# Altium project MotorBoard.PrjPcb
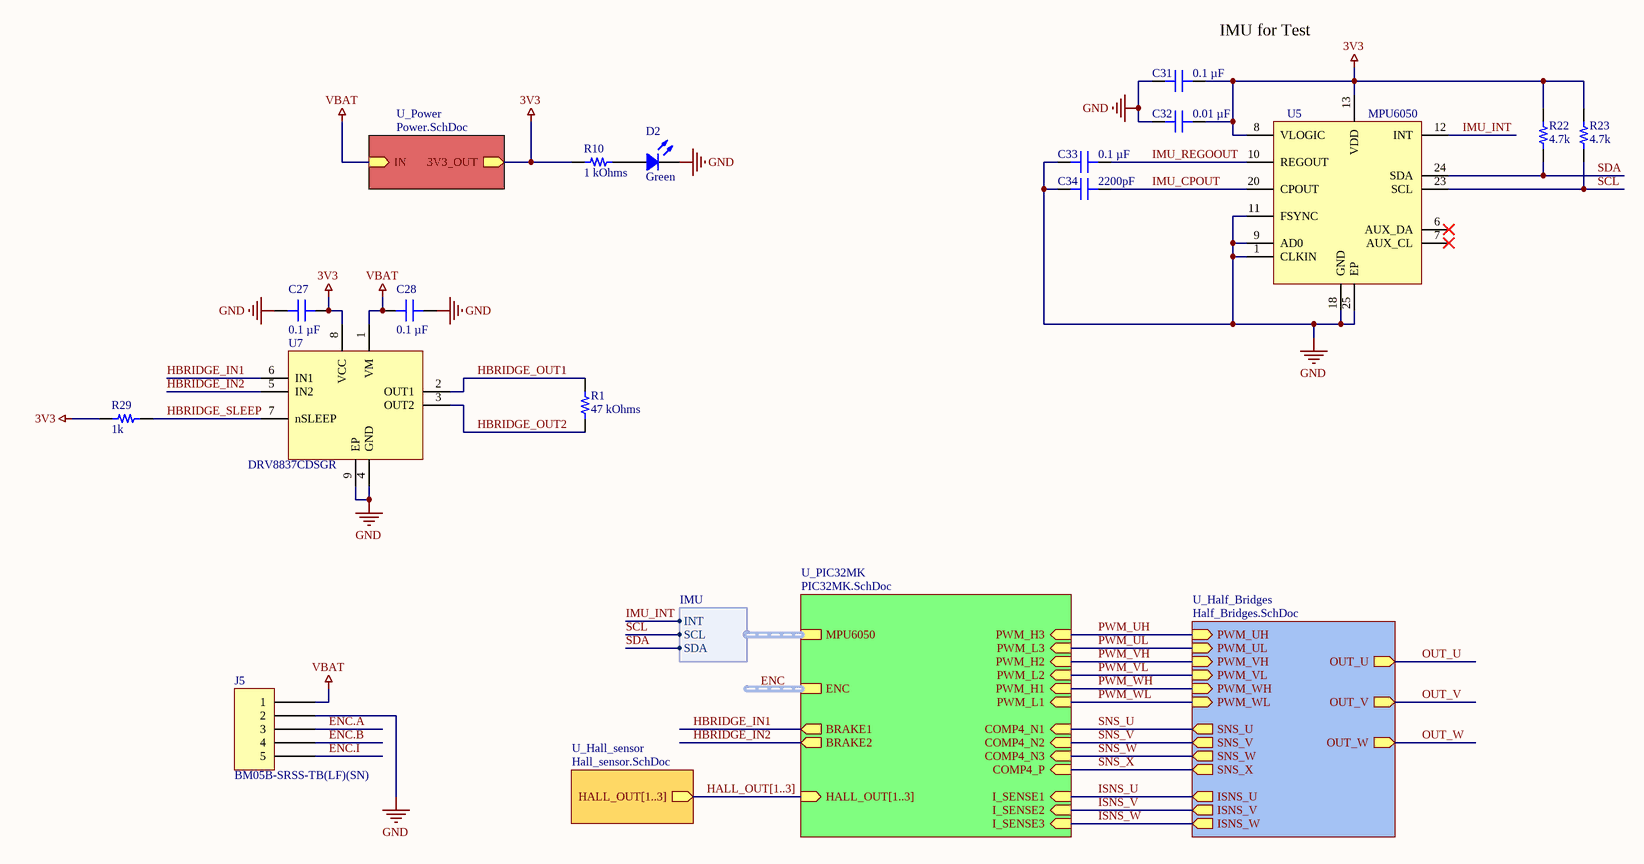
[diagram p0: Top.SchDoc]
Project: Cubli; ProjectRevision: 1.1
4 sheets, 109 parts. Net scope: hierarchical (ports join the sheet entries above them; power ports are global).
Board file: MotorBoard.PcbDoc
Sheets:
  Top.SchDoc
    U_PIC32MK = PIC32MK.SchDoc
    U_Power = Power.SchDoc
    U_Half_Bridges = Half_Bridges.SchDoc

## Sheet Top.SchDoc
size B; DocumentNumber: 5; Revision: 1.1; SheetNumber: 1; SheetTotal: 5

### Parts
(Parts that share a designator on the sheet are numbered #1, #2 ... from top to bottom, then left to right.)
C27  0.1 µF  [CAP 0402_1005]
C28  0.1 µF  [CAP 0402_1005]
C31  0.1 µF  [CAP 0402_1005]
C32  0.01 µF  [CAP 0402_1005]
C33  0.1 µF  [CAP 0402_1005]
C34  2200pF  [CAP 0402_1005]
D2  Green  [LED 0603_1608 GREEN]
J5  BM05B-SRSS-TB(LF)(SN)  [JST BM05B-SRSS-TB]
R1#1  47 kOhms  [RES 2512_6432]
R10#1  1 kOhms  [RES 0603_1608]
R22  4.7k  [RES 0402_1005]
R23  4.7k  [RES 0402_1005]
R29  1k  [RES 0402_1005]
U5  MPU6050  [IC_MPU6050]
U7#1  DRV8837CDSGR  [SON50P200X200X80-9N]

### Sub-sheets
U_Half_Bridges = Half_Bridges.SchDoc: PWM_UH (in), PWM_UL (in), PWM_VH (in), PWM_VL (in), PWM_WH (in), PWM_WL (in), SNS_U (out), SNS_V (out), SNS_W (out), SNS_X (out), OUT_U (out), OUT_V (out), OUT_W (out), ISNS_U (out), ISNS_V (out), ISNS_W (out)
U_Hall_sensor = Hall_sensor.SchDoc (file not in this document): HALL_OUT[1..3] (out)
U_PIC32MK = PIC32MK.SchDoc: HALL_OUT[1..3] (in), BRAKE2 (out), BRAKE1 (out), MPU6050 (harness IMU), PWM_L1 (in), PWM_H1 (in), PWM_L2 (in), PWM_H2 (in), PWM_L3 (in), PWM_H3 (in), ENC (harness ENC), I_SENSE1 (in), I_SENSE2 (in), I_SENSE3 (in), COMP4_P (in), COMP4_N1 (in), COMP4_N2 (in), COMP4_N3 (in)
U_Power = Power.SchDoc: 3V3_OUT (out), IN (in)

### Harnesses
IMU: INT, SCL, SDA

### Nets
3V3: C27.2 C31.2 C32.2 R10#1.1 R22.1 R23.1 R29.1 U5.8(VLOGIC) U5.13(VDD) U7#1.8(VCC) ; sheet U_Power/3V3_OUT
GND: C27.1 C28.2 C31.1 C32.1 C33.1 C34.1 D2.2 J5.2 U5.1(CLKIN) U5.9(AD0) U5.11(FSYNC) U5.18(GND) U5.25(EP) U7#1.4(GND) U7#1.9(EP)
VBAT: C28.1 J5.1 U7#1.1(VM) ; sheet U_Power/IN
ENC.A: J5.3
ENC.B: J5.4
ENC.I: J5.5
HBRIDGE_IN1: U7#1.6(IN1) ; sheet U_PIC32MK/BRAKE1
HBRIDGE_IN2: U7#1.5(IN2) ; sheet U_PIC32MK/BRAKE2
HBRIDGE_OUT1: R1#1.1 U7#1.2(OUT1)
HBRIDGE_OUT2: R1#1.2 U7#1.3(OUT2)
HBRIDGE_SLEEP: R29.2 U7#1.7(nSLEEP)
IMU_CPOUT: C34.2 U5.20(CPOUT)
IMU_INT: U5.12(INT) ; sheet U_PIC32MK/MPU6050.INT
IMU_REGOOUT: C33.2 U5.10(REGOUT)
ISNS_U: sheet U_PIC32MK/I_SENSE1, sheet U_Half_Bridges/ISNS_U
ISNS_V: sheet U_PIC32MK/I_SENSE2, sheet U_Half_Bridges/ISNS_V
ISNS_W: sheet U_PIC32MK/I_SENSE3, sheet U_Half_Bridges/ISNS_W
PWM_UH: sheet U_PIC32MK/PWM_H3, sheet U_Half_Bridges/PWM_UH
PWM_UL: sheet U_PIC32MK/PWM_L3, sheet U_Half_Bridges/PWM_UL
PWM_VH: sheet U_PIC32MK/PWM_H2, sheet U_Half_Bridges/PWM_VH
PWM_VL: sheet U_PIC32MK/PWM_L2, sheet U_Half_Bridges/PWM_VL
PWM_WH: sheet U_PIC32MK/PWM_H1, sheet U_Half_Bridges/PWM_WH
PWM_WL: sheet U_PIC32MK/PWM_L1, sheet U_Half_Bridges/PWM_WL
SCL: R23.2 U5.23(SCL) ; sheet U_PIC32MK/MPU6050.SCL
SDA: R22.2 U5.24(SDA) ; sheet U_PIC32MK/MPU6050.SDA
SNS_U: sheet U_PIC32MK/COMP4_N1, sheet U_Half_Bridges/SNS_U
SNS_V: sheet U_PIC32MK/COMP4_N2, sheet U_Half_Bridges/SNS_V
SNS_W: sheet U_PIC32MK/COMP4_N3, sheet U_Half_Bridges/SNS_W
SNS_X: sheet U_PIC32MK/COMP4_P, sheet U_Half_Bridges/SNS_X
NetD2_1: D2.1 R10#1.2

Not connected (* = marked no-connect by the designer): U5 6(AUX_DA)* 7(AUX_CL)*

### Buses and harness runs
bus HALL_OUT[1..3] = sheet U_Hall_sensor/HALL_OUT[1..3] = sheet U_PIC32MK/HALL_OUT[1..3]
harness ENC = sheet U_PIC32MK/ENC

### Notes on the sheet
- (near C31) IMU for Test

### Library data of the parts
C27 C28 C31 C33 = C0402C104K4RACAUTO: CAP CER 0.1UF 16V X7R 0402; manufacturer: KEMET; Tolerance: ±10%; Part Number: C0402C104K4RACAUTO; Value: 0.1 µF; Applications: Automotive, Bypass, Decoupling; Capacitance: 0.1 µF; componentlink1description: Datasheet; componentlink1url: https://api.kemet.com/component-edge/download/specsheet/C0402C104K4RACAUTO.pdf; componentlink2description: DigiKey Link; componentlink2url: https://www.digikey.com/en/products/detail/kemet/C0402C104K4RACAUTO/3314827; Device Package: 0402 (1005 Metric); lastupdated: 8/14/2022 9:05:51 PM; Lifecycle Status: Active; Minimum Order: 1; Mounting Type: Surface Mount, MLCC; Operating Temperature: -55°C ~ 125°C; Package / Case: 0402 (1005 Metric); packaging: TapeAndReel; partid: 3024; Part Status: Active; price: 0.01; Ratings: AEC-Q200; series: SMD Auto X7R; Size / Dimension: 0.039" L x 0.020" W (1.00mm x 0.50mm); Supplier 1: DigiKey; Supplier Part Number 1: 399-6828-1-ND; Temperature Coefficient: X7R; Thickness (Max): 0.022" (0.55mm); Voltage - Rated: 16V
C32 C34 = C0402C104K4RACAUTO: CAP CER 0.1UF 16V X7R 0402; manufacturer: KEMET; Capacitance: 0.1 µF; Tolerance: ±10%; Part Number: C0402C104K4RACAUTO; Applications: Automotive, Bypass, Decoupling; componentlink1description: Datasheet; componentlink1url: https://api.kemet.com/component-edge/download/specsheet/C0402C104K4RACAUTO.pdf; componentlink2description: DigiKey Link; componentlink2url: https://www.digikey.com/en/products/detail/kemet/C0402C104K4RACAUTO/3314827; Device Package: 0402 (1005 Metric); lastupdated: 8/14/2022 9:05:51 PM; Lifecycle Status: Active; Minimum Order: 1; Mounting Type: Surface Mount, MLCC; Operating Temperature: -55°C ~ 125°C; Package / Case: 0402 (1005 Metric); packaging: TapeAndReel; partid: 3024; Part Status: Active; price: 0.01; Ratings: AEC-Q200; series: SMD Auto X7R; Size / Dimension: 0.039" L x 0.020" W (1.00mm x 0.50mm); Supplier 1: DigiKey; Supplier Part Number 1: 399-6828-1-ND; Temperature Coefficient: X7R; Thickness (Max): 0.022" (0.55mm); Voltage - Rated: 16V
  C32: Value: 0.01 µF
  C34: Value: 2200pF
D2 = XZCDGK53W-8VF: 1.6X0.8MM LC GREEN PIXSOLED DOME; Manufacturer: SunLED; Configuration: Independent; Current - Test: 2mA; Lens Color: Colorless; Lens Size: 0.35mm Dia; Lens Style: Round with Domed Top; Lens Transparency: Clear; Millicandela Rating: 417mcd; Viewing Angle: 60°; Voltage - Forward (Vf) (Typ): 2.65V; Wavelength - Dominant: 525nm; Wavelength - Peak: 515nm; Part Number: XZCDGK53W-8VF; Color: Green; ComponentLink1Description: Datasheet; ComponentLink1URL: https://www.sunledusa.com/products/spec/XZCDGK53W-8VF.pdf; ComponentLink2Description: DigiKey Link; ComponentLink2URL: http://digikey.com/product-detail/en/sunled/XZCDGK53W-8VF/1497-XZCDGK53W-8VFCT-ND/10449792; Device Package: 0603 (1608 Metric); Height (Max): 1.10mm; LastUpdated: 21-Jan-20 3:12:09 AM; Lifecycle Status: Active; Minimum Order: 1; Mounting Type: Surface Mount; Package / Case: 0603 (1608 Metric); Packaging: Unknown; PartId: 938; Part Status: Active; Price: 0.18; Series: Ultra Low Current; Size / Dimension: 1.60mm L x 0.80mm W; Supplier 1: DigiKey; Supplier Part Number 1: 1497-XZCDGK53W-8VFCT-ND; Supplier Device Package: 2-SMD; Value: Green
J5 = BM05B-SRSS-TB(LF)(SN): CONN HEADER SMD 5POS 1MM; Manufacturer: JST Sales America Inc.; Current Rating (Amps): 0.7A; Material Flammability Rating: UL94 V-0; Number of Positions: 5; Number of Positions Loaded: All; Pitch - Mating: 0.039" (1.00mm); Shrouding: Shrouded - 4 Wall; Style: Board to Cable/Wire; Voltage Rating: 50V; Part Number: BM05B-SRSS-TB(LF)(SN); ComponentLink1Description: Datasheet; ComponentLink1URL: http://www.jst-mfg.com/product/pdf/eng/eSR.pdf; ComponentLink2Description: DigiKey Link; ComponentLink2URL: http://digikey.com/product-detail/en/jst-sales-america-inc/BM05B-SRSS-TB-LF-SN/455-1791-1-ND/926862; Connector Type: Header; Contact Finish - Mating: Tin; Contact Finish - Post: Tin; Contact Material: Copper Alloy; Contact Shape: Square; Contact Type: Male Pin; Fastening Type: Push-Pull; Features: Solder Retention; Insulation Color: Natural; Insulation Height: 0.167" (4.25mm); Insulation Material: Polyamide (PA), Nylon; LastUpdated: 1/12/2020 10:14:00 PM; Lifecycle Status: Active; Minimum Order: 1; Mounting Type: Surface Mount; Number of Rows: 1; Operating Temperature: -25°C ~ 85°C; Packaging: TapeAndReel; PartId: 18; Part Status: Active; Price: 0.35; Series: SR; Supplier 1: DigiKey; Supplier Part Number 1: 455-1791-1-ND; Termination: Solder
R1#1 = RK73B3ATTE473J: RES 47K OHM 5% 1W 2512; Manufacturer: KOA Speer Electronics, Inc.; Temperature Coefficient: ±200ppm/°C; Part Number: RK73B3ATTE473J; ComponentLink1Description: Datasheet; ComponentLink1URL: http://www.koaspeer.com/catimages/Products/RK73B/RK73B.pdf; ComponentLink2Description: DigiKey Link; ComponentLink2URL: http://digikey.com/product-detail/en/koa-speer-electronics-inc/RK73B3ATTE473J/2019-RK73B3ATTE473JCT-ND/10425370; Composition: Thick Film; Device Package: 2512 (6432 Metric); Features: Automotive AEC-Q200, Moisture Resistant; Height - Seated (Max): 0.028" (0.70mm); LastUpdated: 21-Jan-20 4:26:21 AM; Lifecycle Status: Active; Minimum Order: 1; Number of Terminations: 2; Operating Temperature: -55°C ~ 155°C; Package / Case: 2512 (6432 Metric); Packaging: TapeAndReel; Part Status: Active; Power (Watts): 1W; Price: 0.04; Ratings: AEC-Q200; Resistance: 47 kOhms; Series: RK73B; Size / Dimension: 0.248" L x 0.122" W (6.30mm x 3.10mm); Supplier 1: DigiKey; Supplier Part Number 1: 2019-RK73B3ATTE473JCT-ND; Supplier Device Package: 2512; Tolerance: ±5%; Value: 47 kOhms
R10#1 = RNCF0603DTE1K00: RES 1K OHM 0.5% 1/10W 0603; Manufacturer: Stackpole Electronics Inc; Power (Watts): 0.1W, 1/10W; Temperature Coefficient: ±25ppm/°C; Part Number: RNCF0603DTE1K00; Value: 1 kOhms; ComponentLink1Description: Datasheet; ComponentLink1URL: https://www.seielect.com/catalog/sei-rncf.pdf; ComponentLink2Description: DigiKey Link; ComponentLink2URL: http://digikey.com/product-detail/en/stackpole-electronics-inc/RNCF0603DTE1K00/RNCF0603DTE1K00CT-ND/9915086; Composition: Thin Film; Device Package: 0603 (1608 Metric); Features: Automotive AEC-Q200; Height - Seated (Max): 0.022" (0.55mm); LastUpdated: 21-Jan-20 12:14:28 AM; Lifecycle Status: Active; Minimum Order: 1; Number of Terminations: 2; Operating Temperature: -55°C ~ 155°C; Package / Case: 0603 (1608 Metric); Packaging: TapeAndReel; PartId: 26300; Part Status: Active; Price: 0.05; Ratings: AEC-Q200; Resistance: 1 kOhms; Series: RNCF; Size / Dimension: 0.061" L x 0.031" W (1.55mm x 0.80mm); Supplier 1: DigiKey; Supplier Part Number 1: RNCF0603DTE1K00CT-ND; Supplier Device Package: 0603; Tolerance: ±0.5%
R22 R23 R29 = RK73H1ETTP1432F: RES 14.3K OHM 1% 1/10W 0402; Manufacturer: KOA Speer Electronics, Inc.; Power (Watts): 0.1W, 1/10W; Resistance: 14.3 kOhms; Temperature Coefficient: ±100ppm/°C; Part Number: RK73H1ETTP1432F; ComponentLink1Description: Datasheet; ComponentLink1URL: http://www.koaspeer.com/catimages/Products/RK73H/RK73H.pdf; ComponentLink2Description: DigiKey Link; ComponentLink2URL: https://www.digikey.com/en/products/detail/koa-speer-electronics-inc/RK73H1ETTP1432F/9844351; Composition: Thick Film; Device Package: 0402 (1005 Metric); Features: Automotive AEC-Q200, Moisture Resistant; Height - Seated (Max): 0.016" (0.40mm); LastUpdated: 8/14/2022 9:23:49 PM; Lifecycle Status: Active; Minimum Order: 1; Number of Terminations: 2; Operating Temperature: -55°C ~ 155°C; Package / Case: 0402 (1005 Metric); Packaging: CutTape; PartId: 10193; Part Status: Active; Price: 0.01; Ratings: AEC-Q200; Series: RK73H; Size / Dimension: 0.039" L x 0.020" W (1.00mm x 0.50mm); Supplier 1: DigiKey; Supplier Part Number 1: 2019-RK73H1ETTP1432FCT-ND; Supplier Device Package: 0402; Tolerance: ±1%
  R22 R23: Value: 4.7k
  R29: Value: 1k
U7#1 = DRV8837CDSGR: 11-V, 1-A H-bridge motor driver 8-WSON -40 to 85; MF: Texas Instruments; Mouser-Purchase-URL: https://snapeda.com/shop?store=Mouser&id=617854; Value: *; DigiKey-Purchase-URL: https://snapeda.com/shop?store=DigiKey&id=617854; Package: WSON-8 Texas Instruments; Texas_Instruments-Purchase-URL: https://snapeda.com/shop?store=Texas+Instruments&id=617854; Price: None; MP: DRV8837CDSGR; SnapEDA_Link: https://www.snapeda.com/parts/DRV8837CDSGR/Texas%20Instruments/view-part/617854/?ref=snap; Availability: Good

## Sheet PIC32MK.SchDoc
size B; DocumentNumber: 3; SheetNumber: 3; SheetTotal: 5
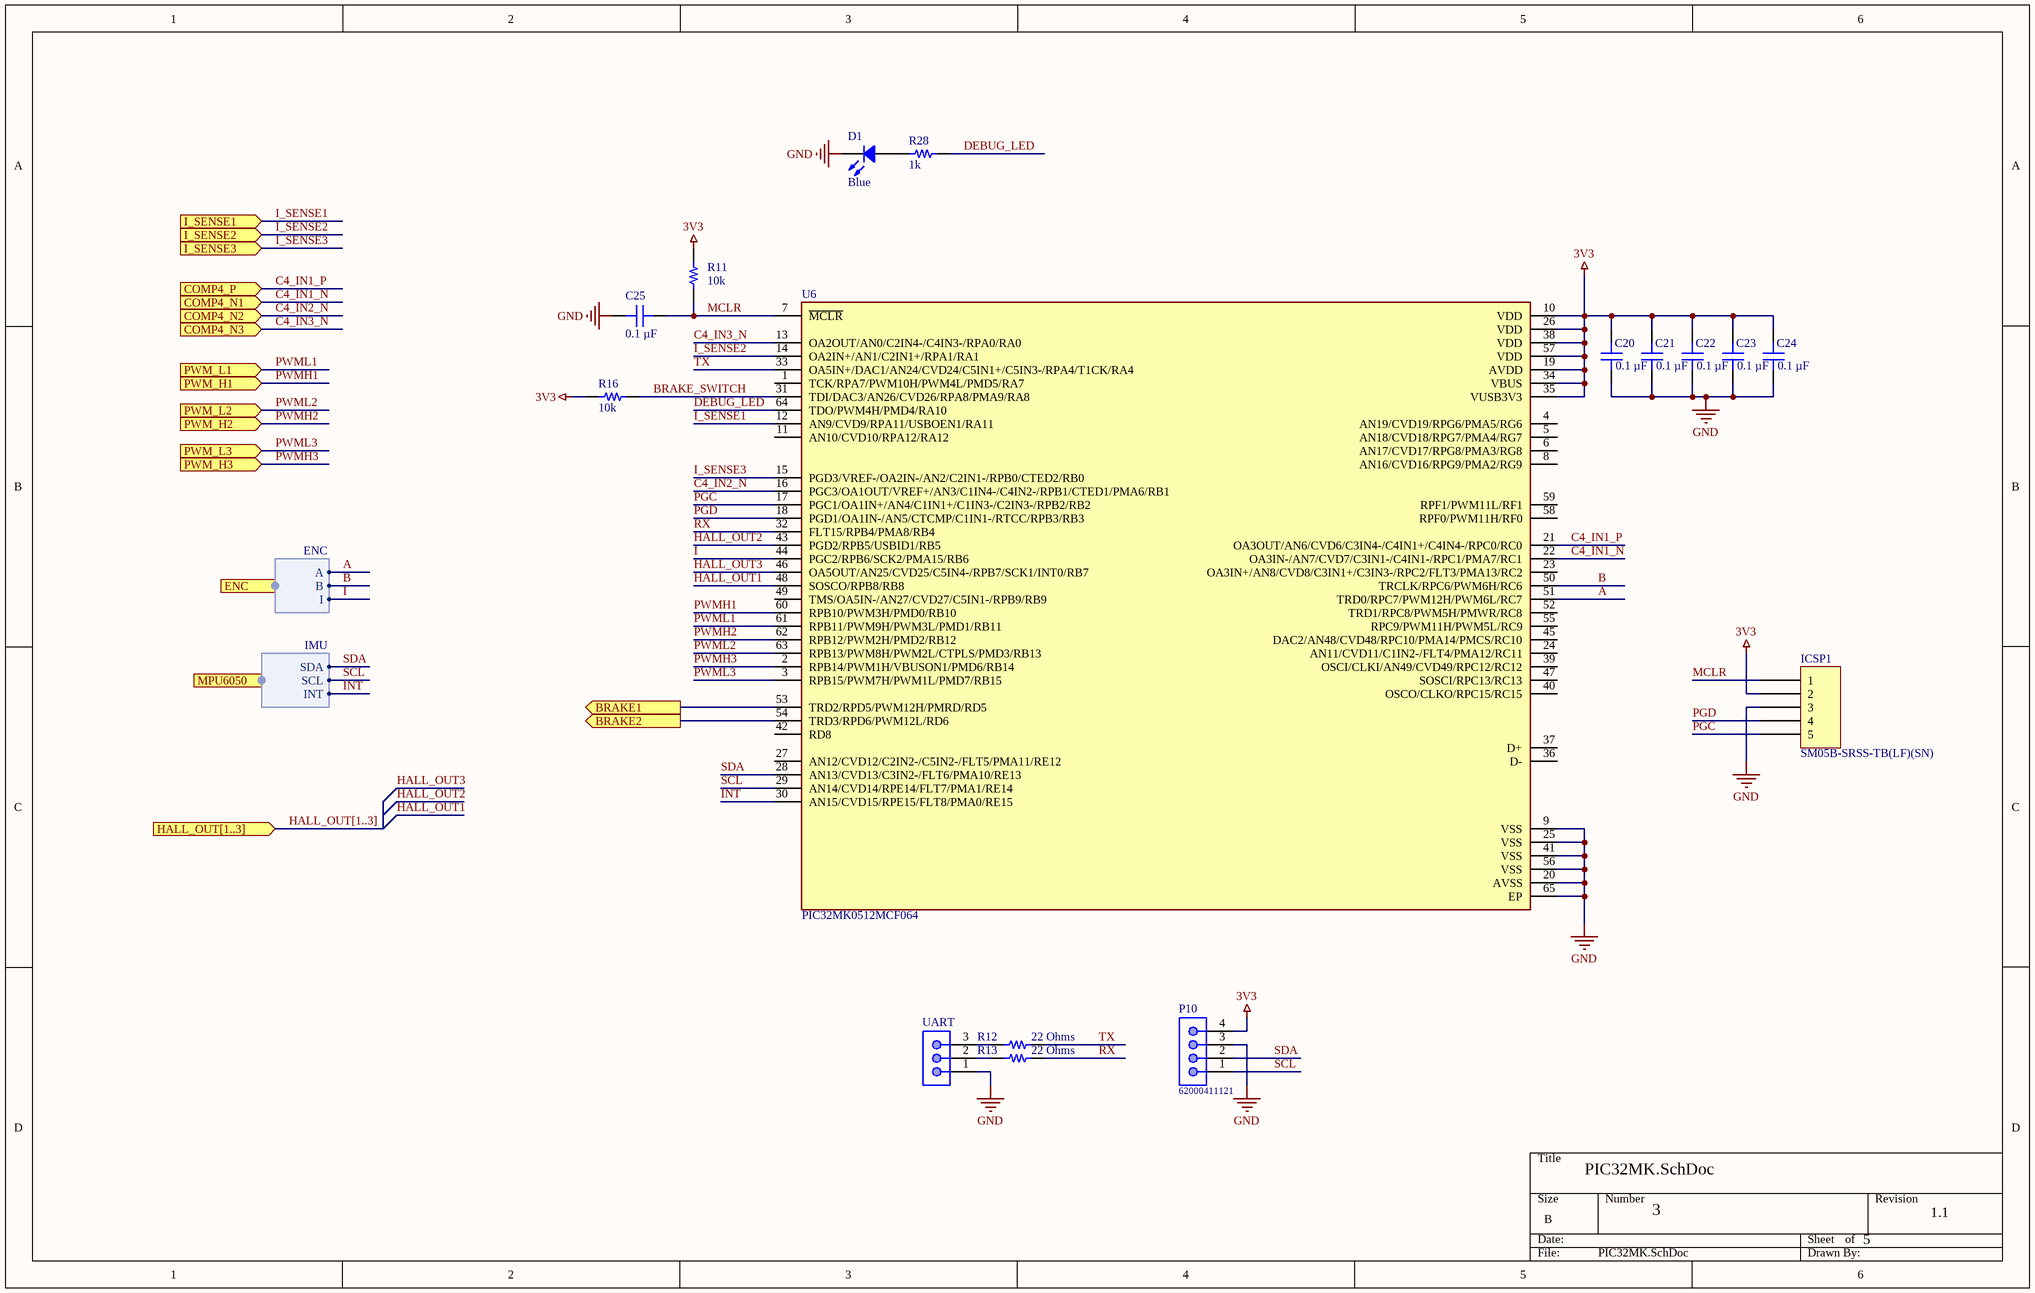
[diagram p1: PIC32MK.SchDoc]

### Parts
(Parts that share a designator on the sheet are numbered #1, #2 ... from top to bottom, then left to right.)
C20  0.1 µF  [CAP 0402_1005]
C21  0.1 µF  [CAP 0402_1005]
C22  0.1 µF  [CAP 0402_1005]
C23  0.1 µF  [CAP 0402_1005]
C24  0.1 µF  [CAP 0402_1005]
C25  0.1 µF  [CAP 0402_1005]
D1  Blue  [LED 0603_1608 GREEN]
ICSP1  SM05B-SRSS-TB(LF)(SN)  [JST SM05B-SRSS-TB]
P10  62000411121  [62000411121]
R11  10k  [RES 0402_1005]
R12#1  22 Ohms  [RES 0402_1005]
R13#1  22 Ohms  [RES 0402_1005]
R16#1  10k  [RES 0402_1005]
R28  1k  [RES 0402_1005]
U6  PIC32MK0512MCF064  [QFN50P900X900X100-65N]
UART  3 pin 2mm JST Male  [3pin - 2mm header]  (value not drawn)

### Ports
BRAKE1 (out), BRAKE2 (out), COMP4_N1 (in), COMP4_N2 (in), COMP4_N3 (in), COMP4_P (in), ENC (harness ENC), HALL_OUT[1..3] (in), I_SENSE1 (in), I_SENSE2 (in), I_SENSE3 (in), MPU6050 (harness IMU), PWM_H1 (in), PWM_H2 (in), PWM_H3 (in), PWM_L1 (in), PWM_L2 (in), PWM_L3 (in)

### Harnesses
IMU: SDA, SCL, INT
ENC: A, B, I

### Nets
3V3: C20.2 C21.2 C22.2 C23.2 C24.2 ICSP1.2 P10.4 R11.2 R16#1.2 U6.10(VDD) U6.19(AVDD) U6.26(VDD) U6.34(VBUS) U6.35(VUSB3V3) U6.38(VDD) U6.57(VDD)
GND: C20.1 C21.1 C22.1 C23.1 C24.1 C25.2 D1.2 ICSP1.3 P10.3 U6.9(VSS) U6.20(AVSS) U6.25(VSS) U6.41(VSS) U6.56(VSS) U6.65(EP) UART.1
A: U6.51(TRD0/RPC7/PWM12H/PWM6L/RC7) ; port ENC.A  [project net ENC.A]
B: U6.50(TRCLK/RPC6/PWM6H/RC6) ; port ENC.B  [project net ENC.B]
BRAKE_SWITCH: R16#1.1 U6.31(TDI/DAC3/AN26/CVD26/RPA8/PMA9/RA8)
C4_IN1_N: U6.22(OA3IN-/AN7/CVD7/C3IN1-/C4IN1-/RPC1/PMA7/RC1) ; port COMP4_N1  [project net SNS_U]
C4_IN1_P: U6.21(OA3OUT/AN6/CVD6/C3IN4-/C4IN1+/C4IN4-/RPC0/RC0) ; port COMP4_P  [project net SNS_X]
C4_IN2_N: U6.16(PGC3/OA1OUT/VREF+/AN3/C1IN4-/C4IN2-/RPB1/CTED1/PMA6/RB1) ; port COMP4_N2  [project net SNS_V]
C4_IN3_N: U6.13(OA2OUT/AN0/C2IN4-/C4IN3-/RPA0/RA0) ; port COMP4_N3  [project net SNS_W]
DEBUG_LED: R28.1 U6.64(TDO/PWM4H/PMD4/RA10)
HALL_OUT1: U6.48(SOSCO/RPB8/RB8)
HALL_OUT2: U6.43(PGD2/RPB5/USBID1/RB5)
HALL_OUT3: U6.46(OA5OUT/AN25/CVD25/C5IN4-/RPB7/SCK1/INT0/RB7)
HBRIDGE_IN1: U6.53(TRD2/RPD5/PWM12H/PMRD/RD5) ; port BRAKE1
HBRIDGE_IN2: U6.54(TRD3/RPD6/PWM12L/RD6) ; port BRAKE2
I: U6.44(PGC2/RPB6/SCK2/PMA15/RB6) ; port ENC.I  [project net ENC.I]
I_SENSE1: U6.12(AN9/CVD9/RPA11/USBOEN1/RA11) ; port I_SENSE1  [project net ISNS_U]
I_SENSE2: U6.14(OA2IN+/AN1/C2IN1+/RPA1/RA1) ; port I_SENSE2  [project net ISNS_V]
I_SENSE3: U6.15(PGD3/VREF-/OA2IN-/AN2/C2IN1-/RPB0/CTED2/RB0) ; port I_SENSE3  [project net ISNS_W]
INT: U6.30(AN15/CVD15/RPE15/FLT8/PMA0/RE15) ; port MPU6050.INT  [project net IMU_INT]
MCLR: C25.1 ICSP1.1 R11.1 U6.7(~{MCLR})
PGC: ICSP1.5 U6.17(PGC1/OA1IN+/AN4/C1IN1+/C1IN3-/C2IN3-/RPB2/RB2)
PGD: ICSP1.4 U6.18(PGD1/OA1IN-/AN5/CTCMP/C1IN1-/RTCC/RPB3/RB3)
PWMH1: U6.60(RPB10/PWM3H/PMD0/RB10) ; port PWM_H1  [project net PWM_WH]
PWMH2: U6.62(RPB12/PWM2H/PMD2/RB12) ; port PWM_H2  [project net PWM_VH]
PWMH3: U6.2(RPB14/PWM1H/VBUSON1/PMD6/RB14) ; port PWM_H3  [project net PWM_UH]
PWML1: U6.61(RPB11/PWM9H/PWM3L/PMD1/RB11) ; port PWM_L1  [project net PWM_WL]
PWML2: U6.63(RPB13/PWM8H/PWM2L/CTPLS/PMD3/RB13) ; port PWM_L2  [project net PWM_VL]
PWML3: U6.3(RPB15/PWM7H/PWM1L/PMD7/RB15) ; port PWM_L3  [project net PWM_UL]
RX: R13#1.1 U6.32(FLT15/RPB4/PMA8/RB4)
SCL: P10.1 U6.29(AN14/CVD14/RPE14/FLT7/PMA1/RE14) ; port MPU6050.SCL
SDA: P10.2 U6.28(AN13/CVD13/C3IN2-/FLT6/PMA10/RE13) ; port MPU6050.SDA
TX: R12#1.1 U6.33(OA5IN+/DAC1/AN24/CVD24/C5IN1+/C5IN3-/RPA4/T1CK/RA4)
NetD1_1: D1.1 R28.2
NetR12#1_2: R12#1.2 UART.3
NetR13#1_2: R13#1.2 UART.2

Not connected (* = marked no-connect by the designer): U6 1(TCK/RPA7/PWM10H/PWM4L/PMD5/RA7) 4(AN19/CVD19/RPG6/PMA5/RG6) 5(AN18/CVD18/RPG7/PMA4/RG7) 6(AN17/CVD17/RPG8/PMA3/RG8) 8(AN16/CVD16/RPG9/PMA2/RG9) 11(AN10/CVD10/RPA12/RA12) 23(OA3IN+/AN8/CVD8/C3IN1+/C3IN3-/RPC2/FLT3/PMA13/RC2) 24(AN11/CVD11/C1IN2-/FLT4/PMA12/RC11) 27(AN12/CVD12/C2IN2-/C5IN2-/FLT5/PMA11/RE12) 36(D-) 37(D+) 39(OSCI/CLKI/AN49/CVD49/RPC12/RC12) 40(OSCO/CLKO/RPC15/RC15) 42(RD8) 45(DAC2/AN48/CVD48/RPC10/PMA14/PMCS/RC10) 47(SOSCI/RPC13/RC13) 49(TMS/OA5IN-/AN27/CVD27/C5IN1-/RPB9/RB9) 52(TRD1/RPC8/PWM5H/PMWR/RC8) 55(RPC9/PWM11H/PWM5L/RC9) 58(RPF0/PWM11H/RF0) 59(RPF1/PWM11L/RF1)

### Buses and harness runs
bus HALL_OUT[1..3] = port HALL_OUT[1..3]

### Library data of the parts
C20-C25 = C0402C104K4RACAUTO: as C27 on sheet Top; Part Number: C0402C104K4RACAUTO; Value: 0.1 µF; Applications: Automotive, Bypass, Decoupling; Capacitance: 0.1 µF; componentlink1description: Datasheet; componentlink1url: https://api.kemet.com/component-edge/download/specsheet/C0402C104K4RACAUTO.pdf; componentlink2description: DigiKey Link; componentlink2url: https://www.digikey.com/en/products/detail/kemet/C0402C104K4RACAUTO/3314827; Device Package: 0402 (1005 Metric); lastupdated: 8/14/2022 9:05:51 PM; Lifecycle Status: Active; Minimum Order: 1; Mounting Type: Surface Mount, MLCC; Operating Temperature: -55°C ~ 125°C; Package / Case: 0402 (1005 Metric); packaging: TapeAndReel; partid: 3024; Part Status: Active; price: 0.01; Ratings: AEC-Q200; series: SMD Auto X7R; Size / Dimension: 0.039" L x 0.020" W (1.00mm x 0.50mm); Supplier 1: DigiKey; Supplier Part Number 1: 399-6828-1-ND; Temperature Coefficient: X7R; Thickness (Max): 0.022" (0.55mm); Voltage - Rated: 16V
D1 = XZCDGK53W-8VF: Blue LED; Manufacturer: SunLED; Color: Green; Configuration: Independent; Current - Test: 2mA; Lens Color: Colorless; Lens Size: 0.35mm Dia; Lens Style: Round with Domed Top; Lens Transparency: Clear; Millicandela Rating: 417mcd; Value: Green; Viewing Angle: 60°; Voltage - Forward (Vf) (Typ): 2.65V; Wavelength - Dominant: 525nm; Wavelength - Peak: 515nm; Part Number: XZCDGK53W-8VF; ComponentLink1Description: Datasheet; ComponentLink1URL: https://www.sunledusa.com/products/spec/XZCDGK53W-8VF.pdf; ComponentLink2Description: DigiKey Link; ComponentLink2URL: http://digikey.com/product-detail/en/sunled/XZCDGK53W-8VF/1497-XZCDGK53W-8VFCT-ND/10449792; Device Package: 0603 (1608 Metric); Height (Max): 1.10mm; LastUpdated: 21-Jan-20 3:12:09 AM; Lifecycle Status: Active; Minimum Order: 1; Mounting Type: Surface Mount; Package / Case: 0603 (1608 Metric); Packaging: Unknown; PartId: 938; Part Status: Active; Price: 0.18; Series: Ultra Low Current; Size / Dimension: 1.60mm L x 0.80mm W; Supplier 1: DigiKey; Supplier Part Number 1: 1497-XZCDGK53W-8VFCT-ND; Supplier Device Package: 2-SMD
ICSP1 = SM05B-SRSS-TB(LF)(SN): CONN HEADER SMD R/A 5POS 1MM; Manufacturer: JST Sales America Inc.; Current Rating (Amps): 0.7A; Material Flammability Rating: UL94 V-0; Number of Positions: 5; Number of Positions Loaded: All; Pitch - Mating: 0.039" (1.00mm); Shrouding: Shrouded - 4 Wall; Style: Board to Cable/Wire; Voltage Rating: 50V; Part Number: SM05B-SRSS-TB(LF)(SN); ComponentLink1Description: Datasheet; ComponentLink1URL: http://www.jst-mfg.com/product/pdf/eng/eSH.pdf; ComponentLink2Description: DigiKey Link; ComponentLink2URL: http://digikey.com/product-detail/en/jst-sales-america-inc/SM05B-SRSS-TB-LF-SN/455-1805-1-ND/926876; Connector Type: Header; Contact Finish - Mating: Tin; Contact Finish - Post: Tin; Contact Material: Copper Alloy; Contact Shape: Square; Contact Type: Male Pin; Fastening Type: Push-Pull; Features: Solder Retention; Insulation Color: Natural; Insulation Height: 0.114" (2.90mm); Insulation Material: Polyamide (PA), Nylon; LastUpdated: 1/12/2020 11:42:04 PM; Lifecycle Status: Active; Minimum Order: 1; Mounting Type: Surface Mount, Right Angle; Number of Rows: 1; Operating Temperature: -25°C ~ 85°C; Packaging: TapeAndReel; PartId: 63; Part Status: Active; Price: 0.32; Series: SR; Supplier 1: DigiKey; Supplier Part Number 1: 455-1805-1-ND; Termination: Solder
P10 = 62000411121: WR-PHD Pin Header, THT, pitch 2mm, Single Row, Vertical, 4p; Manufacturer: Wurth Elektronik; Pin Number: 4; Rated Current: 2A; Working Voltage: 200VAC; Withstanding Voltage: 500VAC; Contact Resistance: 20mOhm; ComponentLink1Description: Manufacturer; ComponentLink1URL: http://www.we-online.de; ComponentLink2Description: Datasheet; ComponentLink2URL: https://www.we-online.com/catalog/datasheet/62000411121.pdf; Operating Temperature: -40 to +105degC; Published Date: May 2020; Pitch: 2mm; Manufacturer Part Number: 62000411121; Mounting Technology: THT; Packaging: Bag; Gender: Pin Header; Row Number: Single; Orientation: Vertical
R11 R12#1 R13#1 R16#1 R28 = RK73H1ETTP1432F: as R22 on sheet Top; Part Number: RK73H1ETTP1432F; ComponentLink1Description: Datasheet; ComponentLink1URL: http://www.koaspeer.com/catimages/Products/RK73H/RK73H.pdf; ComponentLink2Description: DigiKey Link; ComponentLink2URL: https://www.digikey.com/en/products/detail/koa-speer-electronics-inc/RK73H1ETTP1432F/9844351; Composition: Thick Film; Device Package: 0402 (1005 Metric); Features: Automotive AEC-Q200, Moisture Resistant; Height - Seated (Max): 0.016" (0.40mm); LastUpdated: 8/14/2022 9:23:49 PM; Lifecycle Status: Active; Minimum Order: 1; Number of Terminations: 2; Operating Temperature: -55°C ~ 155°C; Package / Case: 0402 (1005 Metric); Packaging: CutTape; PartId: 10193; Part Status: Active; Price: 0.01; Ratings: AEC-Q200; Series: RK73H; Size / Dimension: 0.039" L x 0.020" W (1.00mm x 0.50mm); Supplier 1: DigiKey; Supplier Part Number 1: 2019-RK73H1ETTP1432FCT-ND; Supplier Device Package: 0402; Tolerance: ±1%
  R11 R16#1: Value: 10k
  R12#1 R13#1: Value: 22 Ohms
  R28: Value: 1k
U6 = PIC32MK0512MCF064: PIC32MK Microcontroller IC 32-Bit 120MHz 1MB _1M x 8_ FLASH 64-TQFP _10x10_; MP: PIC32MK1024MCF064-I/PT; MF: Microchip; Digi-Key_Purchase_URL: https://www.digikey.kr/product-detail/en/microchip-technology/PIC32MK1024MCF064-I-PT/PIC32MK1024MCF064-I-PT-ND/7164902?utm_source=snapeda&utm_medium=aggregator&utm_campaign=symbol; Package: TQFP-64 Microchip; Digi-Key_Part_Number: PIC32MK1024MCF064-I/PT-ND; Value: *; SnapEDA_Link: https://www.snapeda.com/parts/PIC32MK1024MCF064-I/PT/Microchip/view-part/876704/?ref=snap

## Sheet Power.SchDoc
size B; DocumentNumber: 4; SheetNumber: 4; SheetTotal: 5
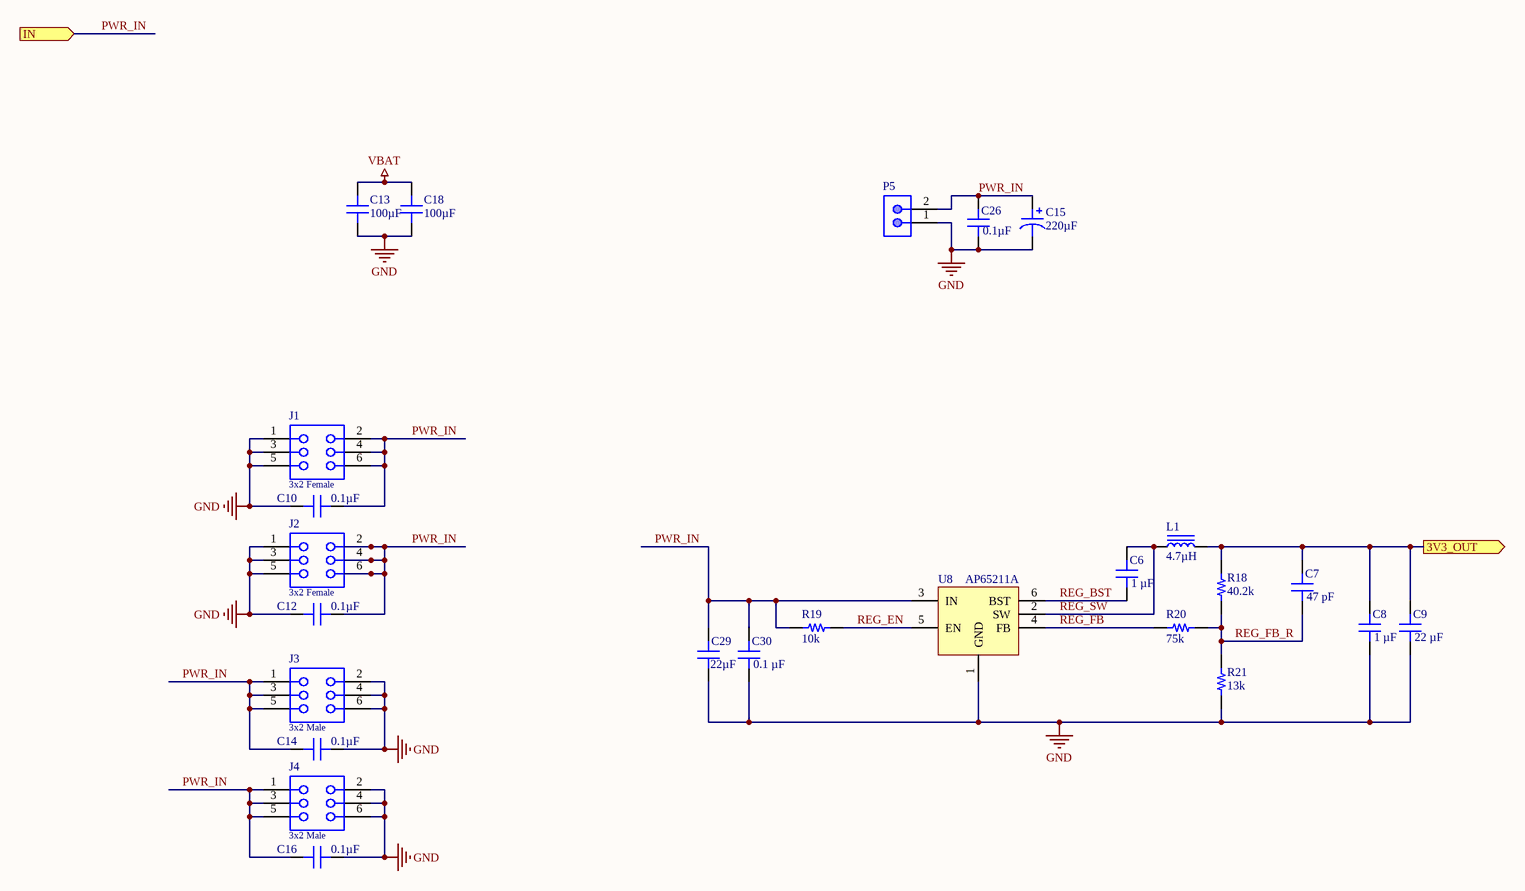
[diagram p2: Power.SchDoc]

### Parts
(Parts that share a designator on the sheet are numbered #1, #2 ... from top to bottom, then left to right.)
C6#1  1 µF  [CAP 0402_1005]
C7#1  47 pF  [CAP 0402_1005]
C8#1  1 µF  [CAP 0402_1005]
C9#1  22 µF  [CAP 0402_1005]
C10  0.1µF  [CAP 0603_1608]
C12  0.1µF  [CAP 0603_1608]
C13  100µF  [CAP 1210_3225 - 2.8MM]
C14  0.1µF  [CAP 0603_1608]
C15  220µF  [CAP POL 2917_7343]
C16  0.1µF  [CAP 0603_1608]
C18#1  100µF  [CAP 1210_3225 - 2.8MM]
C26  0.1µF  [CAP 0603_1608]
C29  22µF  [CAP 0805_2012]
C30  0.1 µF  [CAP 0402_1005]
J1  3x2 Female  [62000621821]
J2  3x2 Female  [62000621821]
J3  3x2 Male  [2mm 3x2 Male Right - duplicate]
J4  3x2 Male  [2mm 3x2 Male Right - duplicate]
L1  4.7µH  [IND 1008_2520]
P5  2 pin 2mm JST Male  [2pin - 2mm JST male]  (value not drawn)
R18  40.2k  [RES 0402_1005]
R19  10k  [RES 0402_1005]
R20  75k  [RES 0402_1005]
R21  13k  [RES 0402_1005]
U8#1  AP65211A  [TSOT-26-6]

### Ports
3V3_OUT (out), IN (in)

### Nets
3V3: C7#1.2 C8#1.2 C9#1.2 L1.2 R18.1 ; port 3V3_OUT
GND: C8#1.1 C9#1.1 C10.1 C12.1 C13.1 C14.2 C15.2 C16.2 C18#1.1 C26.2 C29.1 C30.1 J1.1 J1.3 J1.5 J2.1 J2.3 J2.5 J3.2 J3.4 J3.6 J4.2 J4.4 J4.6 P5.1 R21.2 U8#1.1(GND)
VBAT: C10.2 C12.2 C13.2 C14.1 C15.1 C16.1 C18#1.2 C26.1 C29.2 C30.2 J1.2 J1.4 J1.6 J2.2 J2.4 J2.6 J3.1 J3.3 J3.5 J4.1 J4.3 J4.5 P5.2 R19.2 U8#1.3(IN) ; port IN  [also labelled PWR_IN]
REG_BST: C6#1.1 U8#1.6(BST)
REG_EN: R19.1 U8#1.5(EN)
REG_FB: R20.2 U8#1.4(FB)
REG_FB_R: C7#1.1 R18.2 R20.1 R21.1
REG_SW: C6#1.2 L1.1 U8#1.2(SW)

### Library data of the parts
C6#1 C7#1 C8#1 C9#1 = C0402C104K4RACAUTO: as C32 on sheet Top; Part Number: C0402C104K4RACAUTO; Applications: Automotive, Bypass, Decoupling; componentlink1description: Datasheet; componentlink1url: https://api.kemet.com/component-edge/download/specsheet/C0402C104K4RACAUTO.pdf; componentlink2description: DigiKey Link; componentlink2url: https://www.digikey.com/en/products/detail/kemet/C0402C104K4RACAUTO/3314827; Device Package: 0402 (1005 Metric); lastupdated: 8/14/2022 9:05:51 PM; Lifecycle Status: Active; Minimum Order: 1; Mounting Type: Surface Mount, MLCC; Operating Temperature: -55°C ~ 125°C; Package / Case: 0402 (1005 Metric); packaging: TapeAndReel; partid: 3024; Part Status: Active; price: 0.01; Ratings: AEC-Q200; series: SMD Auto X7R; Size / Dimension: 0.039" L x 0.020" W (1.00mm x 0.50mm); Supplier 1: DigiKey; Supplier Part Number 1: 399-6828-1-ND; Temperature Coefficient: X7R; Thickness (Max): 0.022" (0.55mm); Voltage - Rated: 16V
  C6#1 C8#1: Value: 1 µF
  C7#1: Value: 47 pF
  C9#1: Value: 22 µF
C10 C12 C14 C16 C26 = GCG188R92A104KA03D: CAP CER 0.1UF 100V 0603 EPOXY; Manufacturer: Murata Electronics; Temperature Coefficient: X8R; Tolerance: ±10%; Part Number: GCG188R92A104KA03D; Value: 0.1µF; Applications: Automotive; Capacitance: 0.1µF; ComponentLink1Description: Datasheet; ComponentLink1URL: https://search.murata.co.jp/Ceramy/image/img/A01X/G101/ENG/GCG188R92A104KA03-01.pdf; ComponentLink2Description: DigiKey Link; ComponentLink2URL: http://digikey.com/product-detail/en/murata-electronics/GCG188R92A104KA03D/490-18197-1-ND/9867926; Device Package: 0603 (1608 Metric); Features: Epoxy Mountable; LastUpdated: 21-Jan-20 12:01:59 AM; Lifecycle Status: Active; Minimum Order: 1; Mounting Type: Surface Mount, MLCC, Epoxy; Operating Temperature: -55°C ~ 150°C; Package / Case: 0603 (1608 Metric); Packaging: TapeAndReel; PartId: 9025; Part Status: Active; Price: 0.07; Ratings: AEC-Q200; Series: GCG; Size / Dimension: 0.063" L x 0.031" W (1.60mm x 0.80mm); Supplier 1: DigiKey; Supplier Part Number 1: 490-18197-1-ND; Thickness (Max): 0.035" (0.90mm); Voltage - Rated: 100V
C13 C18#1 = EMK325ABJ107MM-P: CAP CER 100UF 16V X5R 1210; Manufacturer: Taiyo Yuden; Tolerance: ±20%; Part Number: EMK325ABJ107MM-P; Value: 100µF; Applications: General Purpose; Capacitance: 100µF; ComponentLink1Description: Datasheet; ComponentLink1URL: https://ds.yuden.co.jp/TYCOMPAS/ut/detail?pn=EMK325ABJ107MM-P &u=M; ComponentLink2Description: DigiKey Link; ComponentLink2URL: http://digikey.com/product-detail/en/taiyo-yuden/EMK325ABJ107MM-P/587-5426-1-ND/7067102; Device Package: 1210 (3225 Metric); LastUpdated: 21-Jan-20 12:30:21 AM; Lifecycle Status: Active; Minimum Order: 1; Mounting Type: Surface Mount, MLCC; Operating Temperature: -55°C ~ 85°C; Package / Case: 1210 (3225 Metric); Packaging: TapeAndReel; PartId: 24141; Part Status: Active; Price: 0.71; Series: M; Size / Dimension: 0.126" L x 0.098" W (3.20mm x 2.50mm); Supplier 1: DigiKey; Supplier Part Number 1: 587-5426-1-ND; Temperature Coefficient: X5R; Thickness (Max): 0.110" (2.80mm); Voltage - Rated: 16V
C15 = T510X227K016ATE040: CAP TANT 220UF 10% 16V 2917; Manufacturer: KEMET; Manufacturer Size Code: X; ESR (Equivalent Series Resistance): 40mOhm; Lifetime @ Temp.: 2000 Hrs @ 85°C; Type: Molded; Part Number: T510X227K016ATE040; Value: 220µF; Capacitance: 220µF; ComponentLink1Description: Datasheet; ComponentLink1URL: https://api.kemet.com/component-edge/download/datasheet/T510X227K016ATE040.pdf; ComponentLink2Description: DigiKey Link; ComponentLink2URL: http://digikey.com/product-detail/en/kemet/T510X227K016ATE040/399-4805-1-ND/1085524; Device Package: 2917 (7343 Metric); Features: General Purpose; Height - Seated (Max): 0.169" (4.30mm); LastUpdated: 30-Aug-20 8:55:47 PM; Lifecycle Status: Active; Minimum Order: 1; Mounting Type: Surface Mount; Operating Temperature: -55°C ~ 125°C; Package / Case: 2917 (7343 Metric); Packaging: TapeAndReel; PartId: 1966; Part Status: Active; Price: 4.46; Series: T510; Size / Dimension: 0.287" L x 0.169" W (7.30mm x 4.30mm); Supplier 1: DigiKey; Supplier Part Number 1: 399-4805-1-ND; Tolerance: ±10%; Voltage - Rated: 16V
C29 = C2012X7S1E106K125AC: CAP CER 10UF 25V X7S 0805; Manufacturer: TDK Corporation; Capacitance: 10µF; Tolerance: ±10%; Part Number: C2012X7S1E106K125AC; Value: 22µF; Applications: General Purpose; ComponentLink1Description: Datasheet; ComponentLink1URL: https://product.tdk.com/en/search/capacitor/ceramic/mlcc/info?part_no=C2012X7S1E106K125AC?ref_disty=digikey; ComponentLink2Description: DigiKey Link; ComponentLink2URL: http://digikey.com/product-detail/en/tdk-corporation/C2012X7S1E106K125AC/445-181600-1-ND/9991478; Device Package: 0805 (2012 Metric); Features: Low ESL; LastUpdated: 21-Jan-20 12:03:04 AM; Lifecycle Status: Active; Minimum Order: 1; Mounting Type: Surface Mount, MLCC; Operating Temperature: -55°C ~ 125°C; Package / Case: 0805 (2012 Metric); Packaging: TapeAndReel; PartId: 3339; Part Status: Active; Price: 0.15; Series: C; Size / Dimension: 0.079" L x 0.049" W (2.00mm x 1.25mm); Supplier 1: DigiKey; Supplier Part Number 1: 445-181600-1-ND; Temperature Coefficient: X7S; Thickness (Max): 0.057" (1.45mm); Voltage - Rated: 25V
C30 = C0402C104K4RACAUTO: as C27 on sheet Top; Part Number: C0402C104K4RACAUTO; Value: 0.1 µF; Applications: Automotive, Bypass, Decoupling; Capacitance: 0.1 µF; componentlink1description: Datasheet; componentlink1url: https://api.kemet.com/component-edge/download/specsheet/C0402C104K4RACAUTO.pdf; componentlink2description: DigiKey Link; componentlink2url: https://www.digikey.com/en/products/detail/kemet/C0402C104K4RACAUTO/3314827; Device Package: 0402 (1005 Metric); lastupdated: 8/14/2022 9:05:51 PM; Lifecycle Status: Active; Minimum Order: 1; Mounting Type: Surface Mount, MLCC; Operating Temperature: -55°C ~ 125°C; Package / Case: 0402 (1005 Metric); packaging: TapeAndReel; partid: 3024; Part Status: Active; price: 0.01; Ratings: AEC-Q200; series: SMD Auto X7R; Size / Dimension: 0.039" L x 0.020" W (1.00mm x 0.50mm); Supplier 1: DigiKey; Supplier Part Number 1: 399-6828-1-ND; Temperature Coefficient: X7R; Thickness (Max): 0.022" (0.55mm); Voltage - Rated: 16V
J1 J2 = 62000621821: WR-PHD Socket Header, THT, pitch 2mm, Dual Row, Vertical, 6p; Manufacturer: Wurth Elektronik; Pin Number: 6; Rated Current: 2A; Working Voltage: 250VAC; Withstanding Voltage: 500VAC; Contact Resistance: 20mOhm; ComponentLink1Description: Manufacturer; ComponentLink1URL: http://www.we-online.de; ComponentLink2Description: Datasheet; ComponentLink2URL: https://www.we-online.com/catalog/datasheet/62000621821.pdf; Manufacturer Part Number: 62000621821; Published Date: May 2020; Pitch: 2mm; Operating Temperature: -40 to +105degC; Mounting Technology: THT; Packaging: Tube; Gender: Socket Header; Row Number: Dual; Orientation: Vertical
J3 J4 = 2mm Male 3x2 Right: Manufacturer Part Number: 62000621821; Manufacturer: Wurth Elektronik; Pin Number: 6; Gender: Socket Header; Rated Current: 2A; Working Voltage: 250VAC; Withstanding Voltage: 500VAC; Contact Resistance: 20mOhm; Row Number: Dual; ComponentLink1Description: Manufacturer; ComponentLink1URL: http://www.we-online.de; ComponentLink2Description: Datasheet; ComponentLink2URL: https://www.we-online.com/catalog/datasheet/62000621821.pdf; Published Date: May 2020; Pitch: 2mm; Operating Temperature: -40 to +105degC; Mounting Technology: THT; Packaging: Tube; Orientation: Vertical
L1 = MLP2520S4R7ST0S1: FIXED IND 4.7UH 1A 110 MOHM SMD; Manufacturer: TDK Corporation; DC Resistance (DCR): 143mOhm Max; Inductance Frequency - Test: 2MHz; Material - Core: Ferrite; Shielding: Shielded; Tolerance: ±20%; Type: Multilayer; Part Number: MLP2520S4R7ST0S1; ComponentLink1Description: Datasheet; ComponentLink1URL: https://product.tdk.com/info/en/catalog/datasheets/inductor_commercial_power_mlp2520_en.pdf?ref_disty=digikey; ComponentLink2Description: DigiKey Link; ComponentLink2URL: http://digikey.com/product-detail/en/tdk-corporation/MLP2520S4R7ST0S1/445-6378-1-ND/2465705; Current Rating (Amps): 1A; Device Package: 1008 (2520 Metric); Height - Seated (Max): 0.039" (1.00mm); Inductance: 4.7µH; LastUpdated: 13-Aug-20 11:03:40 AM; Lifecycle Status: Active; Minimum Order: 1; Mounting Type: Surface Mount; Operating Temperature: -40°C ~ 125°C; Package / Case: 1008 (2520 Metric); Packaging: TapeAndReel; PartId: 3467; Part Status: Active; Price: 0.14; Series: MLP; Size / Dimension: 0.098" L x 0.079" W (2.50mm x 2.00mm); Supplier 1: DigiKey; Supplier Part Number 1: 445-6378-1-ND; Supplier Device Package: 1008 (2520 Metric); Value: 4.7µH
R18-R21 = RK73H1ETTP1432F: as R22 on sheet Top; Part Number: RK73H1ETTP1432F; ComponentLink1Description: Datasheet; ComponentLink1URL: http://www.koaspeer.com/catimages/Products/RK73H/RK73H.pdf; ComponentLink2Description: DigiKey Link; ComponentLink2URL: https://www.digikey.com/en/products/detail/koa-speer-electronics-inc/RK73H1ETTP1432F/9844351; Composition: Thick Film; Device Package: 0402 (1005 Metric); Features: Automotive AEC-Q200, Moisture Resistant; Height - Seated (Max): 0.016" (0.40mm); LastUpdated: 8/14/2022 9:23:49 PM; Lifecycle Status: Active; Minimum Order: 1; Number of Terminations: 2; Operating Temperature: -55°C ~ 155°C; Package / Case: 0402 (1005 Metric); Packaging: CutTape; PartId: 10193; Part Status: Active; Price: 0.01; Ratings: AEC-Q200; Series: RK73H; Size / Dimension: 0.039" L x 0.020" W (1.00mm x 0.50mm); Supplier 1: DigiKey; Supplier Part Number 1: 2019-RK73H1ETTP1432FCT-ND; Supplier Device Package: 0402; Tolerance: ±1%
  R18: Value: 40.2k
  R19: Value: 10k
  R20: Value: 75k
  R21: Value: 13k
U8#1 = AP65211A: ADJ step down Buck

## Sheet Half_Bridges.SchDoc
size B; DocumentNumber: 6; SheetNumber: 4; SheetTotal: 4
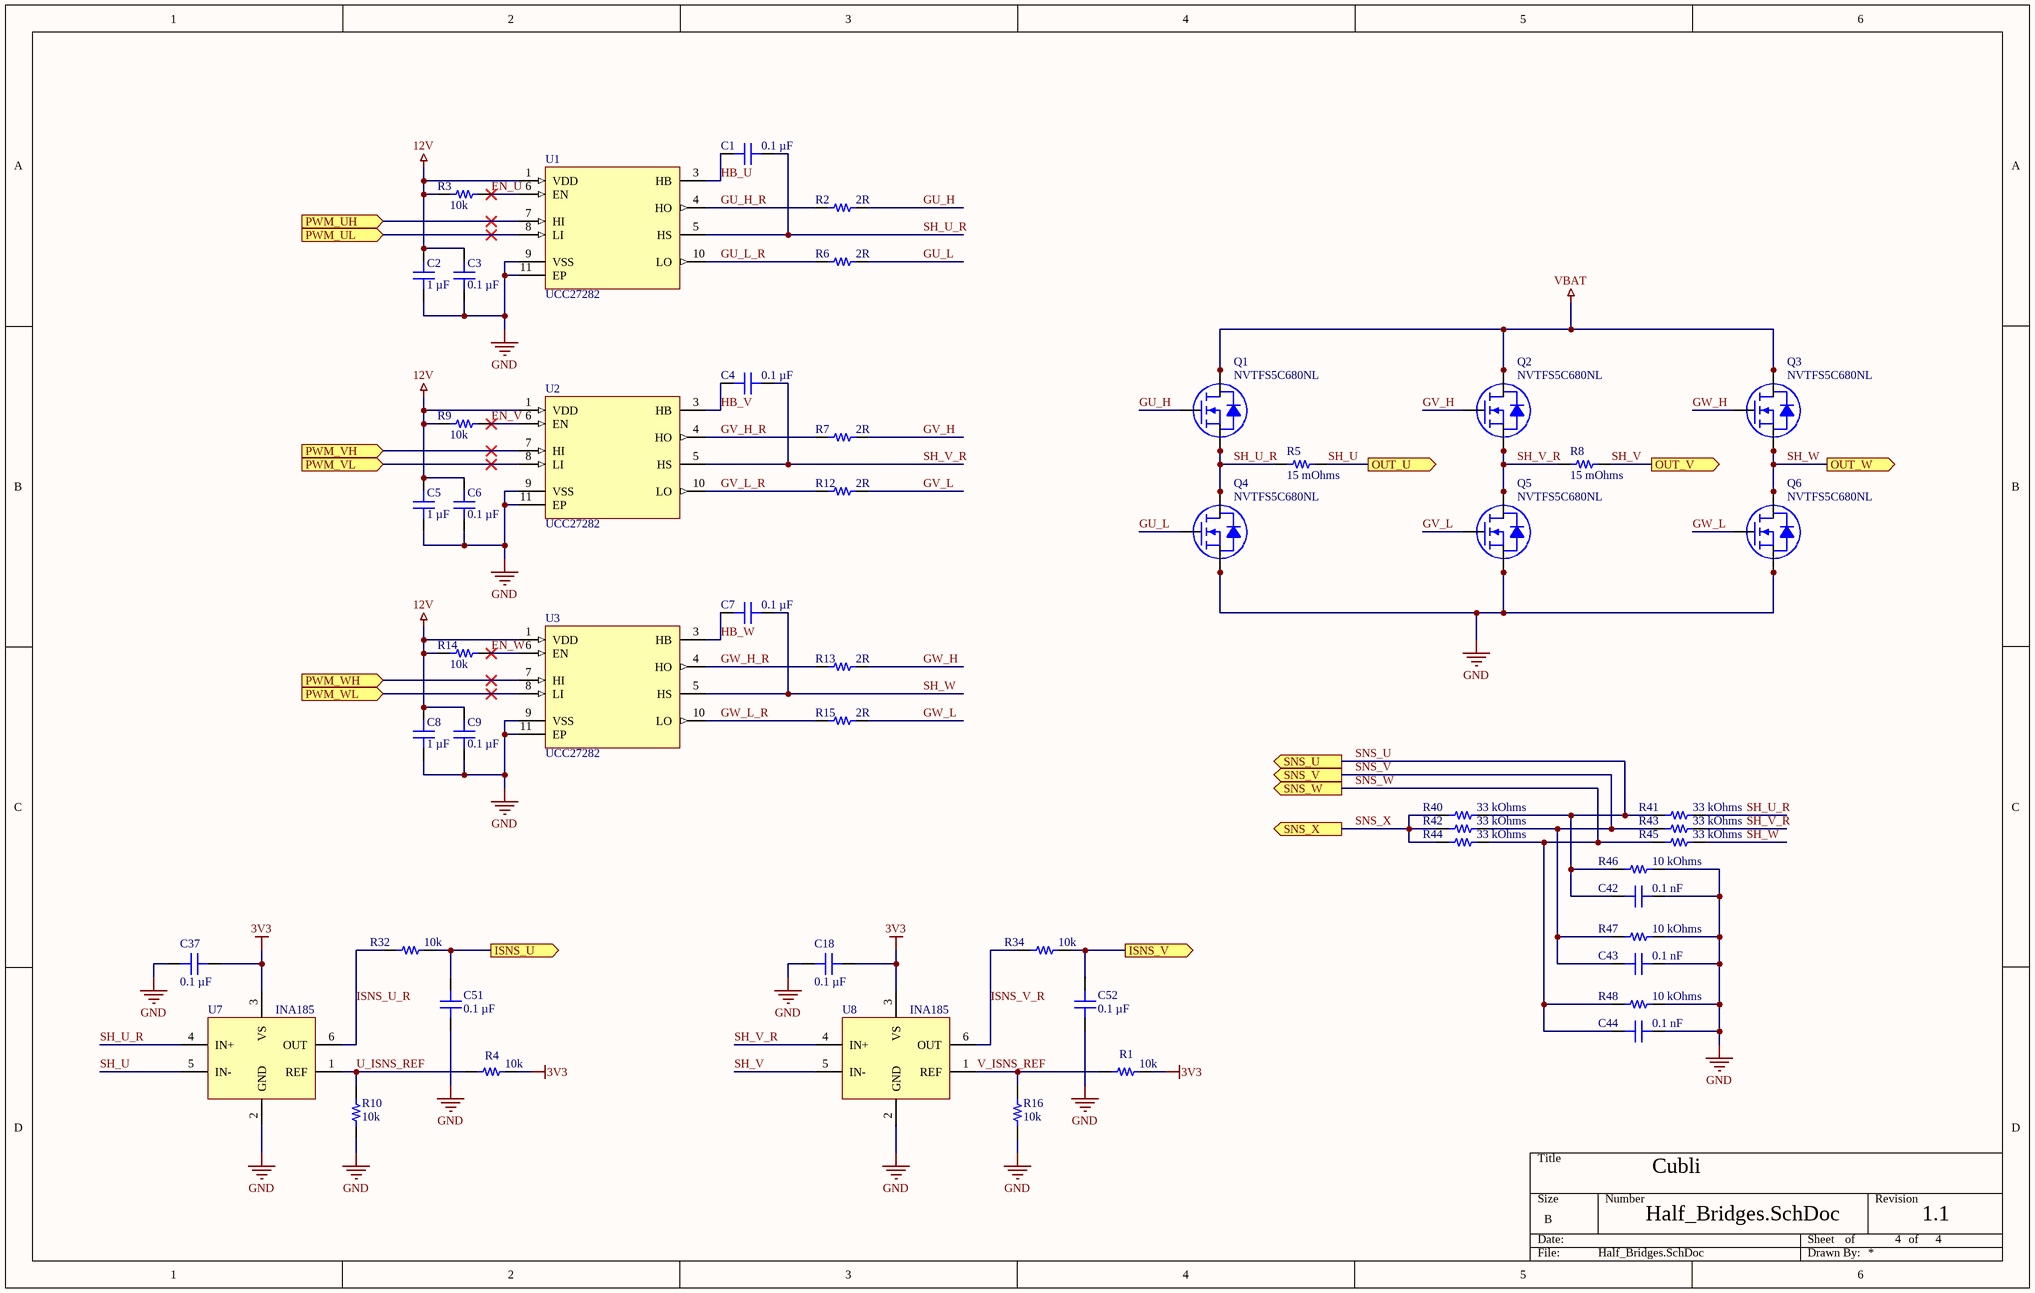
[diagram p3: Half_Bridges.SchDoc]

### Parts
(Parts that share a designator on the sheet are numbered #1, #2 ... from top to bottom, then left to right.)
C1  0.1 µF  [CAP 0402_1005]
C2  1 µF  [CAP 0402_1005]
C3  0.1 µF  [CAP 0402_1005]
C4  0.1 µF  [CAP 0402_1005]
C5  1 µF  [CAP 0402_1005]
C6#2  0.1 µF  [CAP 0402_1005]
C7#2  0.1 µF  [CAP 0402_1005]
C8#2  1 µF  [CAP 0402_1005]
C9#2  0.1 µF  [CAP 0402_1005]
C18#2  0.1 µF  [CAP 0402_1005]
C37  0.1 µF  [CAP 0402_1005]
C42  0.1 nF  [CAP 0402_1005]
C43  0.1 nF  [CAP 0402_1005]
C44  0.1 nF  [CAP 0402_1005]
C51  0.1 µF  [CAP 0402_1005]
C52  0.1 µF  [CAP 0402_1005]
Q1  NVTFS5C680NL  [NVTFS015N04CTAG]
Q2  NVTFS5C680NL  [NVTFS015N04CTAG]
Q3  NVTFS5C680NL  [NVTFS015N04CTAG]
Q4  NVTFS5C680NL  [NVTFS015N04CTAG]
Q5  NVTFS5C680NL  [NVTFS015N04CTAG]
Q6  NVTFS5C680NL  [NVTFS015N04CTAG]
R1#2  10k  [RES 0402_1005]
R2  2R  [RES 0402_1005]
R3  10k  [RES 0402_1005]
R4  10k  [RES 0402_1005]
R5  15 mOhms  [RES 0805_2012]
R6  2R  [RES 0402_1005]
R7  2R  [RES 0402_1005]
R8  15 mOhms  [RES 0805_2012]
R9  10k  [RES 0402_1005]
R10#2  10k  [RES 0402_1005]
R12#2  2R  [RES 0402_1005]
R13#2  2R  [RES 0402_1005]
R14  10k  [RES 0402_1005]
R15  2R  [RES 0402_1005]
R16#2  10k  [RES 0402_1005]
R32  10k  [RES 0402_1005]
R34  10k  [RES 0402_1005]
R40  33 kOhms  [RES 0402_1005]
R41  33 kOhms  [RES 0402_1005]
R42  33 kOhms  [RES 0402_1005]
R43  33 kOhms  [RES 0402_1005]
R44  33 kOhms  [RES 0402_1005]
R45  33 kOhms  [RES 0402_1005]
R46  10 kOhms  [RES 0402_1005]
R47  10 kOhms  [RES 0402_1005]
R48  10 kOhms  [RES 0402_1005]
U1  UCC27282  [VSON-10]
U2  UCC27282  [VSON-10]
U3  UCC27282  [VSON-10]
U7#2  INA185  [TI SC70-6 DCK]
U8#2  INA185  [TI SC70-6 DCK]

### Ports
ISNS_U (out), ISNS_V (out), OUT_U (out), OUT_V (out), OUT_W (out), PWM_UH (in), PWM_UL (in), PWM_VH (in), PWM_VL (in), PWM_WH (in), PWM_WL (in), SNS_U (out), SNS_V (out), SNS_W (out), SNS_X (out)

### Nets
3V3: C18#2.1 C37.1 R1#2.2 R4.2 U7#2.3(VS) U8#2.3(VS)
12V: C2.1 C3.1 C5.1 C6#2.1 C8#2.1 C9#2.1 R3.2 R9.2 R14.2 U1.1(VDD) U2.1(VDD) U3.1(VDD)
GND: C2.2 C3.2 C5.2 C6#2.2 C8#2.2 C9#2.2 C18#2.2 C37.2 C42.1 C43.1 C44.1 C51.2 C52.2 Q4.1(S) Q4.2(S) Q4.3(S) Q5.1(S) Q5.2(S) Q5.3(S) Q6.1(S) Q6.2(S) Q6.3(S) R10#2.1 R16#2.1 R46.1 R47.1 R48.1 U1.9(VSS) U1.11(EP) U2.9(VSS) U2.11(EP) U3.9(VSS) U3.11(EP) U7#2.2(GND) U8#2.2(GND)
VBAT: Q1.5(D) Q1.6(D) Q1.7(D) Q1.8(D) Q2.5(D) Q2.6(D) Q2.7(D) Q2.8(D) Q3.5(D) Q3.6(D) Q3.7(D) Q3.8(D)
EN_U: R3.1 U1.6(EN)
EN_V: R9.1 U2.6(EN)
EN_W: R14.1 U3.6(EN)
GU_H: Q1.4(G) R2.1
GU_H_R: R2.2 U1.4(HO)
GU_L: Q4.4(G) R6.1
GU_L_R: R6.2 U1.10(LO)
GV_H: Q2.4(G) R7.1
GV_H_R: R7.2 U2.4(HO)
GV_L: Q5.4(G) R12#2.1
GV_L_R: R12#2.2 U2.10(LO)
GW_H: Q3.4(G) R13#2.1
GW_H_R: R13#2.2 U3.4(HO)
GW_L: Q6.4(G) R15.1
GW_L_R: R15.2 U3.10(LO)
HB_U: C1.2 U1.3(HB)
HB_V: C4.2 U2.3(HB)
HB_W: C7#2.2 U3.3(HB)
ISNS_U: C51.1 R32.2 ; port ISNS_U
ISNS_U_R: R32.1 U7#2.6(OUT)
ISNS_V: C52.1 R34.2 ; port ISNS_V
ISNS_V_R: R34.1 U8#2.6(OUT)
PWM_UH: U1.7(HI) ; port PWM_UH
PWM_UL: U1.8(LI) ; port PWM_UL
PWM_VH: U2.7(HI) ; port PWM_VH
PWM_VL: U2.8(LI) ; port PWM_VL
PWM_WH: U3.7(HI) ; port PWM_WH
PWM_WL: U3.8(LI) ; port PWM_WL
SH_U: R5.1 U7#2.5(IN-) ; port OUT_U  [project net OUT_U]
SH_U_R: C1.1 Q1.1(S) Q1.2(S) Q1.3(S) Q4.5(D) Q4.6(D) Q4.7(D) Q4.8(D) R5.2 R41.2 U1.5(HS) U7#2.4(IN+)
SH_V: R8.1 U8#2.5(IN-) ; port OUT_V  [project net OUT_V]
SH_V_R: C4.1 Q2.1(S) Q2.2(S) Q2.3(S) Q5.5(D) Q5.6(D) Q5.7(D) Q5.8(D) R8.2 R43.2 U2.5(HS) U8#2.4(IN+)
SH_W: C7#2.1 Q3.1(S) Q3.2(S) Q3.3(S) Q6.5(D) Q6.6(D) Q6.7(D) Q6.8(D) R45.2 U3.5(HS) ; port OUT_W  [project net OUT_W]
SNS_U: C42.2 R40.2 R41.1 R46.2 ; port SNS_U
SNS_V: C43.2 R42.2 R43.1 R47.2 ; port SNS_V
SNS_W: C44.2 R44.2 R45.1 R48.2 ; port SNS_W
SNS_X: R40.1 R42.1 R44.1 ; port SNS_X
U_ISNS_REF: R4.1 R10#2.2 U7#2.1(REF)
V_ISNS_REF: R1#2.1 R16#2.2 U8#2.1(REF)

### Notes on the sheet
- of

### Library data of the parts
C1 C3 C4 C6#2 C7#2 C9#2 C18#2 C37 C51 C52 = C0402C104K4RACAUTO: as C27 on sheet Top; Part Number: C0402C104K4RACAUTO; Value: 0.1 µF; Applications: Automotive, Bypass, Decoupling; Capacitance: 0.1 µF; componentlink1description: Datasheet; componentlink1url: https://api.kemet.com/component-edge/download/specsheet/C0402C104K4RACAUTO.pdf; componentlink2description: DigiKey Link; componentlink2url: https://www.digikey.com/en/products/detail/kemet/C0402C104K4RACAUTO/3314827; Device Package: 0402 (1005 Metric); lastupdated: 8/14/2022 9:05:51 PM; Lifecycle Status: Active; Minimum Order: 1; Mounting Type: Surface Mount, MLCC; Operating Temperature: -55°C ~ 125°C; Package / Case: 0402 (1005 Metric); packaging: TapeAndReel; partid: 3024; Part Status: Active; price: 0.01; Ratings: AEC-Q200; series: SMD Auto X7R; Size / Dimension: 0.039" L x 0.020" W (1.00mm x 0.50mm); Supplier 1: DigiKey; Supplier Part Number 1: 399-6828-1-ND; Temperature Coefficient: X7R; Thickness (Max): 0.022" (0.55mm); Voltage - Rated: 16V
C2 C5 C8#2 C42-C44 = C0402C104K4RACAUTO: as C32 on sheet Top; Part Number: C0402C104K4RACAUTO; Applications: Automotive, Bypass, Decoupling; componentlink1description: Datasheet; componentlink1url: https://api.kemet.com/component-edge/download/specsheet/C0402C104K4RACAUTO.pdf; componentlink2description: DigiKey Link; componentlink2url: https://www.digikey.com/en/products/detail/kemet/C0402C104K4RACAUTO/3314827; Device Package: 0402 (1005 Metric); lastupdated: 8/14/2022 9:05:51 PM; Lifecycle Status: Active; Minimum Order: 1; Mounting Type: Surface Mount, MLCC; Operating Temperature: -55°C ~ 125°C; Package / Case: 0402 (1005 Metric); packaging: TapeAndReel; partid: 3024; Part Status: Active; price: 0.01; Ratings: AEC-Q200; series: SMD Auto X7R; Size / Dimension: 0.039" L x 0.020" W (1.00mm x 0.50mm); Supplier 1: DigiKey; Supplier Part Number 1: 399-6828-1-ND; Temperature Coefficient: X7R; Thickness (Max): 0.022" (0.55mm); Voltage - Rated: 16V
  C2 C5 C8#2: Value: 1 µF
  C42-C44: Value: 0.1 nF
Q1-Q6 = NVTFS5C680NL: N-FET
R1#2 R2-R4 R6 R7 R9 R10#2 R12#2 R13#2 R14 R15 R16#2 R32 R34 R40-R48 = RK73H1ETTP1432F: as R22 on sheet Top; Part Number: RK73H1ETTP1432F; ComponentLink1Description: Datasheet; ComponentLink1URL: http://www.koaspeer.com/catimages/Products/RK73H/RK73H.pdf; ComponentLink2Description: DigiKey Link; ComponentLink2URL: https://www.digikey.com/en/products/detail/koa-speer-electronics-inc/RK73H1ETTP1432F/9844351; Composition: Thick Film; Device Package: 0402 (1005 Metric); Features: Automotive AEC-Q200, Moisture Resistant; Height - Seated (Max): 0.016" (0.40mm); LastUpdated: 8/14/2022 9:23:49 PM; Lifecycle Status: Active; Minimum Order: 1; Number of Terminations: 2; Operating Temperature: -55°C ~ 155°C; Package / Case: 0402 (1005 Metric); Packaging: CutTape; PartId: 10193; Part Status: Active; Price: 0.01; Ratings: AEC-Q200; Series: RK73H; Size / Dimension: 0.039" L x 0.020" W (1.00mm x 0.50mm); Supplier 1: DigiKey; Supplier Part Number 1: 2019-RK73H1ETTP1432FCT-ND; Supplier Device Package: 0402; Tolerance: ±1%
  R1#2 R3 R4 R9 R10#2 R14 R16#2 R32 R34: Value: 10k
  R2 R6 R7 R12#2 R13#2 R15: Value: 2R
  R40-R45: Value: 33 kOhms
  R46-R48: Value: 10 kOhms
R5 R8 = PCAN0805E2002BST5: RES SMD 20K OHM 0.1% 1W 0805; Manufacturer: Vishay Thin Film; Resistance: 20 kOhms; Temperature Coefficient: ±25ppm/°C; Part Number: PCAN0805E2002BST5; Value: 15 mOhms; ComponentLink1Description: Datasheet; ComponentLink1URL: http://www.vishay.com/docs/60125/pcan.pdf; ComponentLink2Description: DigiKey Link; ComponentLink2URL: http://digikey.com/product-detail/en/vishay-thin-film/PCAN0805E2002BST5/764-1242-1-ND/6003316; Composition: Thin Film; Device Package: 0805 (2012 Metric); Features: Flame Proof, Moisture Resistant, Safety; Height - Seated (Max): 0.018" (0.46mm); LastUpdated: 8/26/2022 12:02:22 PM; Lifecycle Status: Active; Minimum Order: 1; Number of Terminations: 2; Operating Temperature: -55°C ~ 155°C; Package / Case: 0805 (2012 Metric); Packaging: TapeAndReel; PartId: 32096; Part Status: Active; Power (Watts): 1W; Price: 0.59; Series: PCAN; Size / Dimension: 0.080" L x 0.050" W (2.03mm x 1.27mm); Supplier 1: DigiKey; Supplier Part Number 1: 764-1242-1-ND; Supplier Device Package: 0805; Tolerance: ±0.1%
U1-U3 = UCC27282DRCR: 3-A, 120-V half bridge gate driver with 5-V UVLO, interlock and enable 10-VSON -40 to 125; MF: Texas Instruments; Texas_Instruments-Purchase-URL: https://snapeda.com/shop?store=Texas+Instruments&id=3625400; Price: None; Availability: Warning; Package: VSON-10 Texas Instruments; SnapEDA_Link: https://www.snapeda.com/parts/UCC27282DRCR/Texas%20Instruments/view-part/3625400/?ref=snap; DigiKey-Purchase-URL: https://snapeda.com/shop?store=DigiKey&id=3625400; MP: UCC27282DRCR; Value: *
U7#2 U8#2 = INA185: INA185A2

## Nets that join several sheets
3V3: Top (10 pins), PIC32MK (16 pins), Power (5 pins), Half_Bridges (6 pins)
GND: Top (15 pins), PIC32MK (16 pins), Power (27 pins), Half_Bridges (35 pins)
VBAT: Top (C28.1 J5.1 U7#1.1), Power (25 pins), Half_Bridges (12 pins)
HBRIDGE_IN1: Top (U7#1.6), PIC32MK (U6.53)
HBRIDGE_IN2: Top (U7#1.5), PIC32MK (U6.54)
IMU_INT: Top (U5.12), PIC32MK (U6.30)
ISNS_U: PIC32MK (U6.12), Half_Bridges (C51.1 R32.2)
ISNS_V: PIC32MK (U6.14), Half_Bridges (C52.1 R34.2)
PWM_UH: PIC32MK (U6.2), Half_Bridges (U1.7)
PWM_UL: PIC32MK (U6.3), Half_Bridges (U1.8)
PWM_VH: PIC32MK (U6.62), Half_Bridges (U2.7)
PWM_VL: PIC32MK (U6.63), Half_Bridges (U2.8)
PWM_WH: PIC32MK (U6.60), Half_Bridges (U3.7)
PWM_WL: PIC32MK (U6.61), Half_Bridges (U3.8)
SCL: Top (R23.2 U5.23), PIC32MK (P10.1 U6.29)
SDA: Top (R22.2 U5.24), PIC32MK (P10.2 U6.28)
SNS_U: PIC32MK (U6.22), Half_Bridges (C42.2 R40.2 R41.1 R46.2)
SNS_V: PIC32MK (U6.16), Half_Bridges (C43.2 R42.2 R43.1 R47.2)
SNS_W: PIC32MK (U6.13), Half_Bridges (C44.2 R44.2 R45.1 R48.2)
SNS_X: PIC32MK (U6.21), Half_Bridges (R40.1 R42.1 R44.1)

## Assembly variants
Main: not fitted R1